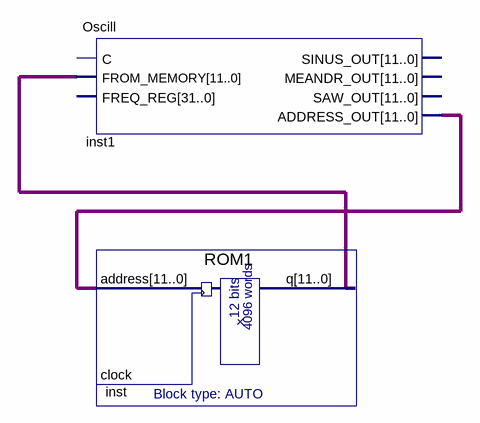
[diagram p0: schematic sheet]
// Quartus schematic TB_OSCILL.bdf as structural Verilog: 2 symbols, 0 pins
module TB_OSCILL (
);

  wire [11:0] inst1_address_out, inst_q;

  Oscill inst1 (
    .FROM_MEMORY(inst_q), .ADDRESS_OUT(inst1_address_out));  // open: C, FREQ_REG, SINUS_OUT, MEANDR_OUT, SAW_OUT
  ROM1 inst (.address(inst1_address_out), .q(inst_q));  // open: clock
endmodule
